# Altium project AES_SSI2130.PrjPcb
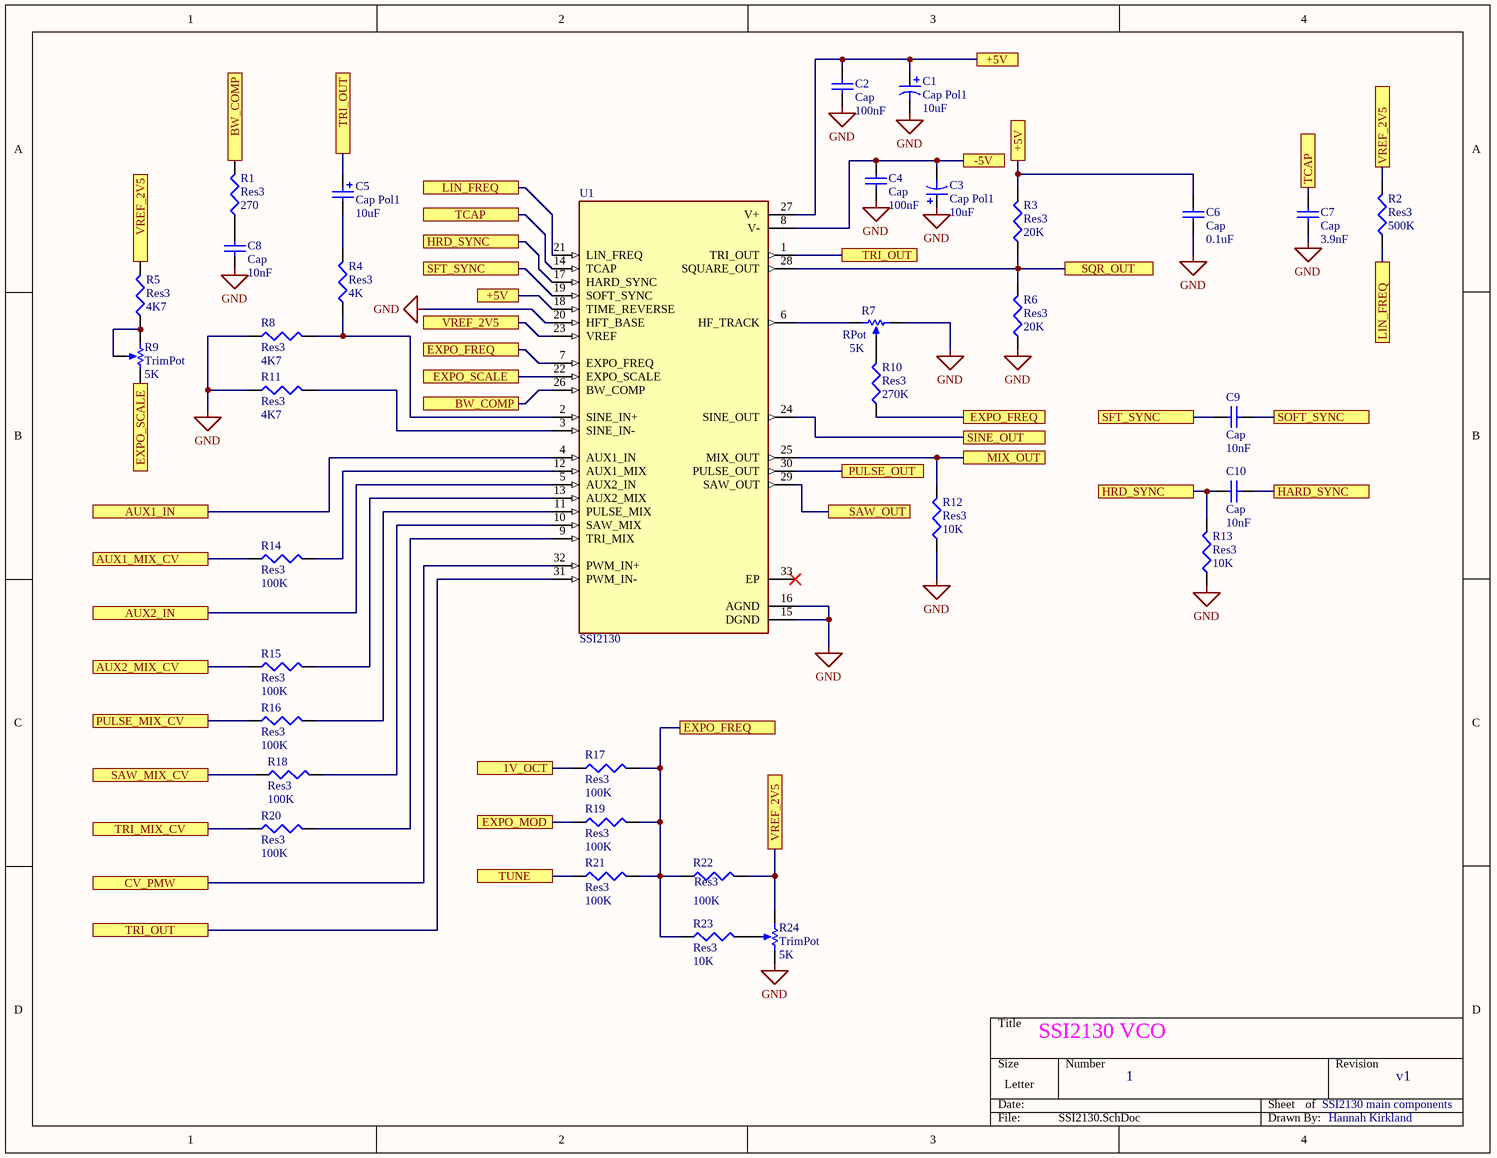
[diagram p0: SSI2130.SchDoc]
Title: Test
7 sheets, 113 parts. Net scope: flat (ports and power ports of the same name join across sheets).
Board file: PCB1.PcbDoc
Sheets:
  SSI2130.SchDoc
  power.SchDoc
  io.SchDoc
  buffNlvlshifter.SchDoc
  flipflop.SchDoc
  buffNlvlshifter2.SchDoc
  Midi_to_CV.SchDoc

## Sheet SSI2130.SchDoc: SSI2130 VCO
size Letter; DrawnBy: Hannah Kirkland; Revision: 1; SheetNumber: 1

### Parts
C1  Cap Pol1  value 10uF  [RB7.6-15]
C2  Cap  value 100nF  [C1206]
C3  Cap Pol1  value 10uF  [RB7.6-15]
C4  Cap  value 100nF  [C1206]
C5  Cap Pol1  value 10uF  [RB7.6-15]
C6  Cap  value 0.1uF  [C1206]
C7  Cap  value 3.9nF  [C1206]
C8  Cap  value 10nF  [C1206]
C9  Cap  value 10nF  [C1206]
C10  Cap  value 10nF  [C1206]
R1  Res3  value 270  [C1206]
R2  Res3  value 500K  [12Z-2010]
R3  Res3  value 20K  [C1206]
R4  Res3  value 4K  [C1206]
R5  Res3  value 4K7  [C1206]
R6  Res3  value 20K  [C1206]
R7  RPot  value 5K  [VR5]
R8  Res3  value 4K7  [C1206]
R9  TrimPot  value 5K  [VR5]
R10  Res3  value 270K  [C1206]
R11  Res3  value 4K7  [C1206]
R12  Res3  value 10K  [C1206]
R13  Res3  value 10K  [C1206]
R14  Res3  value 100K  [C1206]
R15  Res3  value 100K  [C1206]
R16  Res3  value 100K  [C1206]
R17  Res3  value 100K  [C1206]
R18  Res3  value 100K  [C1206]
R19  Res3  value 100K  [C1206]
R20  Res3  value 100K  [C1206]
R21  Res3  value 100K  [C1206]
R22  Res3  value 100K  [C1206]
R23  Res3  value 10K  [C1206]
R24  TrimPot  value 5K  [VR5]
U1  SSI2130  [QFN40P400X400X90-33N]

### Ports
1V_OCT, +5V, -5V, AUX1_IN, AUX1_MIX_CV, AUX2_IN, AUX2_MIX_CV, BW_COMP, CV_PMW, EXPO_FREQ, EXPO_MOD, EXPO_SCALE, HARD_SYNC, HRD_SYNC, LIN_FREQ, MIX_OUT, PULSE_MIX_CV, PULSE_OUT, SAW_MIX_CV, SAW_OUT, SFT_SYNC, SINE_OUT, SOFT_SYNC, SQR_OUT, TCAP, TRI_MIX_CV, TRI_OUT, TUNE, VREF_2V5

### Nets
GND: C1.2 C2.1 C3.1 C4.1 C6.1 C7.1 C8.1 R6.1 R7.2(BOT) R8.1 R11.1 R12.1 R13.1 R24.2(BOT) U1.15(DGND) U1.16(AGND) U1.20(HFT_BASE)
NetC1_1: C1.1 C2.2 C6.2 R3.2 U1.18(TIME_REVERSE) U1.27(V+) ; port +5V
NetC3_2: C3.2 C4.2 U1.8(V-) ; port -5V
NetC5_1: C5.1 U1.1(TRI_OUT) U1.31(PWM_IN-) ; port TRI_OUT
NetC5_2: C5.2 R4.2
NetC7_2: C7.2 U1.14(TCAP) ; port TCAP
NetC8_2: C8.2 R1.1
NetC9_1: C9.1 U1.19(SOFT_SYNC) ; port SFT_SYNC
NetC9_2: C9.2 ; port SOFT_SYNC
NetC10_1: C10.1 R13.2 U1.17(HARD_SYNC) ; port HRD_SYNC
NetC10_2: C10.2 ; port HARD_SYNC
NetC15_1: U1.4(AUX1_IN) ; port AUX1_IN
NetC16_1: U1.5(AUX2_IN) ; port AUX2_IN
NetP1_3: R17.1 ; port 1V_OCT
NetP1_4: R19.1 ; port EXPO_MOD
NetP1_5: R21.1 ; port TUNE
NetP1_8: R14.1 ; port AUX1_MIX_CV
NetP1_9: R15.1 ; port AUX2_MIX_CV
NetP1_10: R16.1 ; port PULSE_MIX_CV
NetP1_11: R18.1 ; port SAW_MIX_CV
NetP1_12: R20.1 ; port TRI_MIX_CV
NetP1_13: R2.1 U1.21(LIN_FREQ) ; port LIN_FREQ
NetP2_6: U1.32(PWM_IN+) ; port CV_PMW
NetP2_11: R2.2 R5.2 R22.2 R24.1(TOP) U1.23(VREF) ; port VREF_2V5
NetR1_2: R1.2 U1.26(BW_COMP) ; port BW_COMP
NetR3_1: R3.1 R6.2 U1.28(SQUARE_OUT) ; port SQR_OUT
NetR4_1: R4.1 R8.2 U1.2(SINE_IN+)
NetR5_1: R5.1 R9.1(TOP) R9.3(TAP)
NetR7_1: R7.1(TOP) U1.6(HF_TRACK)
NetR7_3: R7.3(TAP) R10.2
NetR9_2: R9.2(BOT) U1.22(EXPO_SCALE) ; port EXPO_SCALE
NetR10_1: R10.1 R17.2 R19.2 R21.2 R22.1 R23.1 U1.7(EXPO_FREQ) ; port EXPO_FREQ
NetR11_2: R11.2 U1.3(SINE_IN-)
NetR12_2: R12.2 U1.25(MIX_OUT) ; port MIX_OUT
NetR14_2: R14.2 U1.12(AUX1_MIX)
NetR15_2: R15.2 U1.13(AUX2_MIX)
NetR16_2: R16.2 U1.11(PULSE_MIX)
NetR18_2: R18.2 U1.10(SAW_MIX)
NetR20_2: R20.2 U1.9(TRI_MIX)
NetR23_2: R23.2 R24.3(TAP)
NetR40_1: U1.24(SINE_OUT) ; port SINE_OUT
NetR42_1: U1.30(PULSE_OUT) ; port PULSE_OUT
NetR44_1: U1.29(SAW_OUT) ; port SAW_OUT

Not connected (* = marked no-connect by the designer): U1 33(EP)*

### Notes on the sheet
- SSI2130 VCO
- 1
- SSI2130 main components
- v1
- Hannah Kirkland

### Library data of the parts
C1 C3 C5 = Cap Pol1: Polarized Capacitor (Radial); Published: 8-Jun-2000; LatestRevisionDate: 17-Jul-2002; LatestRevisionNote: Re-released for DXP Platform.; PackageReference: RB7.6-15; Publisher: Altium Limited; PackageDescription: Polarized Capacitor (Radial); 2 Leads
C2 C4 C6-C10 = Cap: Capacitor; Published: 8-Jun-2000; LatestRevisionDate: 17-Jul-2002; LatestRevisionNote: Re-released for DXP Platform.; PackageReference: RAD-0.3; Publisher: Altium Limited; PackageDescription: Radial Cap, Thru-Hole; 2 Leads; 0.3 in Pin Spacing
R1-R6 R8 R10-R23 = Res3: Resistor; Published: 8-Jun-2000; LatestRevisionDate: 29-May-2009; LatestRevisionNote: IPC-7351 Footprint Added.; PackageReference: J1-0603; Publisher: Altium Limited; PackageDescription: Chip Resistor
R7 R9 R24 = RPot: Potentiometer; Sim Note: Enter the Resistance value and the set point into parameter fields.; Set Position: 0.5; Published: 8-Jun-2000; LatestRevisionDate: 17-Jul-2002; LatestRevisionNote: Re-released for DXP Platform.; PackageReference: VR5; Publisher: Altium Limited; PackageDescription: Variable Resistor, Thru-Hole; 3 Leads
U1 = SSI2130: Voltage controlled oscillator subsystem for high-performance electronic musical instruments; MF: Sound Semiconductor; Check_prices: https://www.snapeda.com/parts/SSI2130/Sound%20Semiconductor/view-part/5718733/?ref=eda; SnapEDA_Link: https://www.snapeda.com/parts/SSI2130/Sound%20Semiconductor/view-part/5718733/?ref=snap; Price: None; MP: SSI2130; Value: *; Availability: Unavailable; Package: Package

## Sheet power.SchDoc: Test
size Letter
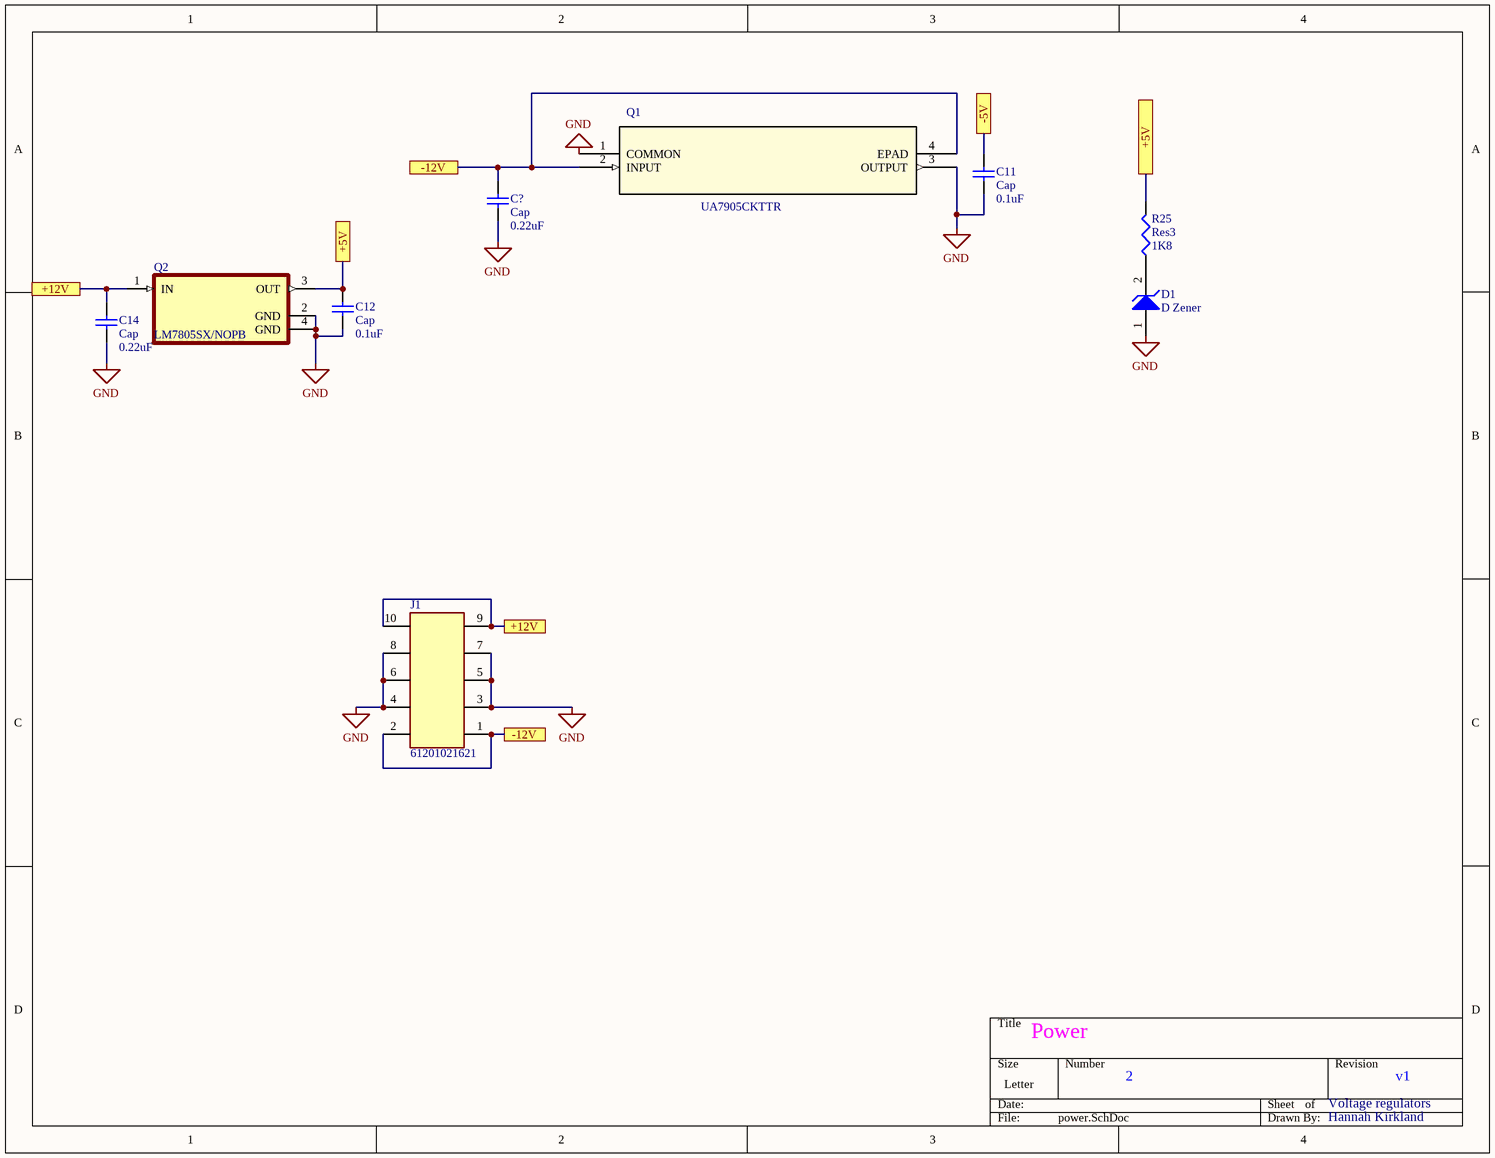
[diagram p1: power.SchDoc]

### Parts
C11  Cap  value 0.1uF  [C1206]
C12  Cap  value 0.1uF  [C1206]
C14  Cap  value 0.22uF  [C1206]
C?  Cap  value 0.22uF  [C1206]
D1  D Zener  [SOT23_N]
J1  61201021621  [61201021621]
Q1  UA7905CKTTR  [TO254P1524X483-4N]
Q2  LM7805SX/NOPB  [TO254P1524X483-4N]
R25  Res3  value 1K8  [C1206]

### Ports
+5V, +12V, -5V, -12V

### Nets
GND: C11.1 C12.1 C14.1 C?.1 D1.1(A) J1.3 J1.4 J1.5 J1.6 J1.7 J1.8 Q1.1(COMMON) Q1.3(OUTPUT) Q2.2(GND) Q2.4(GND)
NetC1_1: C12.2 Q2.3(OUT) R25.2 ; port +5V
NetC3_2: C11.2 ; port -5V
NetC14_2: C14.2 J1.9 J1.10 Q2.1(IN) ; port +12V
NetC18_2: C?.2 J1.1 J1.2 Q1.2(INPUT) Q1.4(EPAD) ; port -12V
NetD1_2: D1.2(K) R25.1

### Notes on the sheet
- Power
- 2
- Voltage regulators
- v1
- Hannah Kirkland

### Library data of the parts
C11 C12 C14 C? = Cap: Capacitor; Published: 8-Jun-2000; LatestRevisionDate: 17-Jul-2002; LatestRevisionNote: Re-released for DXP Platform.; PackageReference: RAD-0.3; Publisher: Altium Limited; PackageDescription: Radial Cap, Thru-Hole; 2 Leads; 0.3 in Pin Spacing
D1 = D Zener: Zener Diode; pin to pad: 1>2 2>3; Published: 8-Jun-2000; LatestRevisionDate: 17-Jul-2002; LatestRevisionNote: Re-released for DXP Platform.; PackageReference: DIODE-0.7; Publisher: Altium Limited; PackageDescription: Diode, Thru-Hole; 2 Leads; 0.7 in Pin Spacing
J1 = 61201021621: Connector Header Through Hole 10 position 0.100 _2.54mm_; MF: Wurth Electronics; Price: None; Package: None; Value: *; MP: 61201021621; Availability: Unavailable; SnapEDA_Link: https://www.snapeda.com/parts/61201021621/Wurth%20Electronics%20Inc./view-part/1156232/?ref=snap
Q1 = UA7905CKTTR: No Description Available; Mfr_Name: Texas Instruments; Type: DEV; Copyright: Copyright (C) 2022 Ultra Librarian. All rights reserved.; Manufacturer_Part_Number: UA7905CKTTR; Digi-Key_Part_Number_1: 296-20799-1-ND; Digi-Key_Part_Number_2: 296-20799-2-ND; Digi-Key_Part_Number_3: 296-20799-6-ND; Digi-Key_Part_Number_4: 2156-UA7905CKTTR-ND; RefDes: RefDes
Q2 = LM7805SX/NOPB: 1.5-A, 30-V, linear voltage regulator 3-DDPAK/TO-263 0 to 125; MF: Texas Instruments; Package: TO-263-3 Texas Instruments; Texas_Instruments-Purchase-URL: https://snapeda.com/shop?store=Texas+Instruments&id=545072; Value: *; Price: None; MP: LM7805SX/NOPB; Availability: Warning; SnapEDA_Link: https://www.snapeda.com/parts/LM7805SX/NOPB/Texas%20Instruments/view-part/545072/?ref=snap; DigiKey-Purchase-URL: https://snapeda.com/shop?store=DigiKey&id=545072; Mouser-Purchase-URL: https://snapeda.com/shop?store=Mouser&id=545072; BuyPart: https://www.snapeda.com/parts/LM7805SX/NOPB/Texas%20Instruments/view-part/545072/?ref=eda
R25 = Res3: Resistor; Published: 8-Jun-2000; LatestRevisionDate: 29-May-2009; LatestRevisionNote: IPC-7351 Footprint Added.; PackageReference: J1-0603; Publisher: Altium Limited; PackageDescription: Chip Resistor

## Sheet io.SchDoc: Test
size Letter
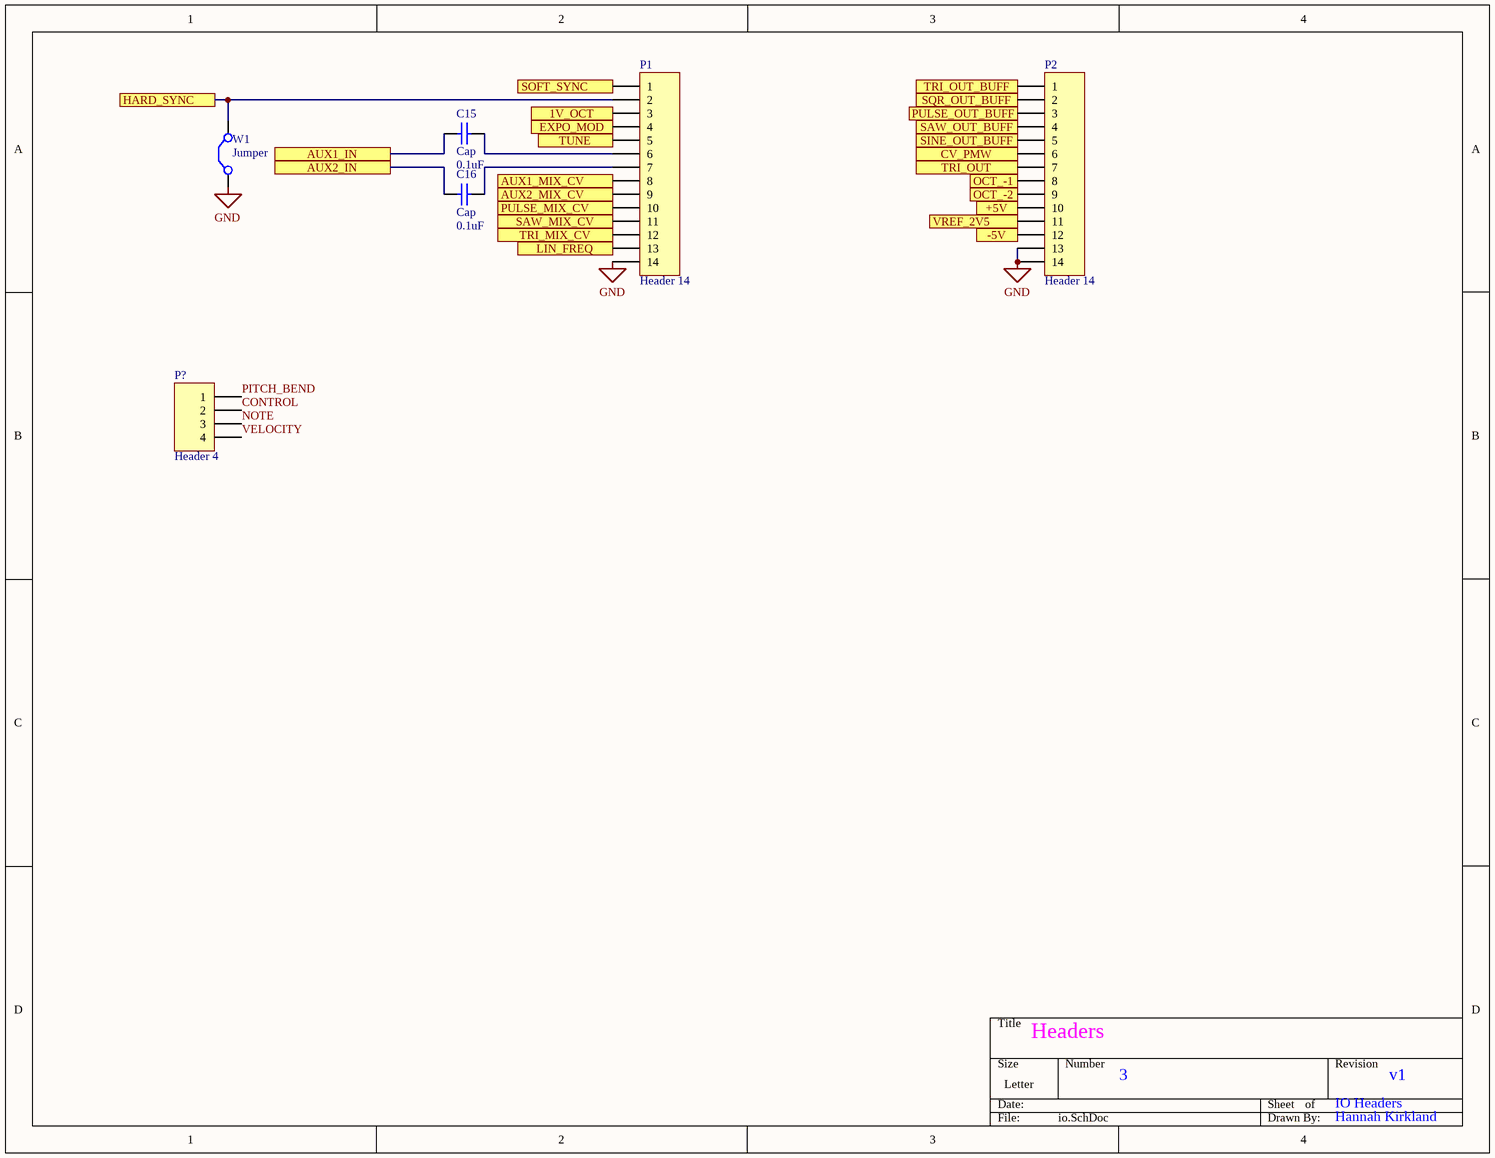
[diagram p2: io.SchDoc]

### Parts
C15  Cap  value 0.1uF  [C1206]
C16  Cap  value 0.1uF  [C1206]
P1  Header 14  [HDR1X14]
P2  Header 14  [HDR1X14]
P?  Header 4  [HDR1X4]
W1  Jumper  [0603]

### Ports
1V_OCT, +5V, -5V, AUX1_IN, AUX1_MIX_CV, AUX2_IN, AUX2_MIX_CV, CV_PMW, EXPO_MOD, HARD_SYNC, LIN_FREQ, OCT_-1, OCT_-2, PULSE_MIX_CV, PULSE_OUT_BUFF, SAW_MIX_CV, SAW_OUT_BUFF, SINE_OUT_BUFF, SOFT_SYNC, SQR_OUT_BUFF, TRI_MIX_CV, TRI_OUT, TRI_OUT_BUFF, TUNE, VREF_2V5

### Nets
GND: P1.14 P2.13 P2.14 W1.1(C1)
CONTROL: P?.2
NOTE: P?.3
PITCH_BEND: P?.1
VELOCITY: P?.4
NetC1_1: P2.10 ; port +5V
NetC3_2: P2.12 ; port -5V
NetC5_1: P2.7 ; port TRI_OUT
NetC9_2: P1.1 ; port SOFT_SYNC
NetC10_2: P1.2 W1.2(C2) ; port HARD_SYNC
NetC15_1: C15.1 ; port AUX1_IN
NetC15_2: C15.2 P1.6
NetC16_1: C16.1 ; port AUX2_IN
NetC16_2: C16.2 P1.7
NetP1_3: P1.3 ; port 1V_OCT
NetP1_4: P1.4 ; port EXPO_MOD
NetP1_5: P1.5 ; port TUNE
NetP1_8: P1.8 ; port AUX1_MIX_CV
NetP1_9: P1.9 ; port AUX2_MIX_CV
NetP1_10: P1.10 ; port PULSE_MIX_CV
NetP1_11: P1.11 ; port SAW_MIX_CV
NetP1_12: P1.12 ; port TRI_MIX_CV
NetP1_13: P1.13 ; port LIN_FREQ
NetP2_1: P2.1 ; port TRI_OUT_BUFF
NetP2_2: P2.2 ; port SQR_OUT_BUFF
NetP2_3: P2.3 ; port PULSE_OUT_BUFF
NetP2_4: P2.4 ; port SAW_OUT_BUFF
NetP2_5: P2.5 ; port SINE_OUT_BUFF
NetP2_6: P2.6 ; port CV_PMW
NetP2_8: P2.8 ; port OCT_-1
NetP2_9: P2.9 ; port OCT_-2
NetP2_11: P2.11 ; port VREF_2V5

### Notes on the sheet
- Headers
- 3
- IO Headers
- v1
- Hannah Kirkland

### Library data of the parts
C15 C16 = Cap: Capacitor; Published: 8-Jun-2000; LatestRevisionDate: 17-Jul-2002; LatestRevisionNote: Re-released for DXP Platform.; PackageReference: RAD-0.3; Publisher: Altium Limited; PackageDescription: Radial Cap, Thru-Hole; 2 Leads; 0.3 in Pin Spacing
P1 P2 = Header 14: Header, 14-Pin; LatestRevisionDate: 17-Jul-2002; LatestRevisionNote: Re-released for DXP Platform.; Publisher: Altium Limited
P? = Header 4: Header, 4-Pin; LatestRevisionDate: 17-Jul-2002; LatestRevisionNote: Re-released for DXP Platform.; Publisher: Altium Limited
W1 = Jumper: Jumper Wire; Published: 24-Mar-1999; LatestRevisionDate: 17-Jul-2002; LatestRevisionNote: Re-released for DXP Platform.; PackageReference: RAD-0.2; Publisher: Altium Limited; PackageDescription: Radial Cap, Thru-Hole; 2 Leads; 0.2 in Pin Spacing

## Sheet buffNlvlshifter.SchDoc: Test
size Letter
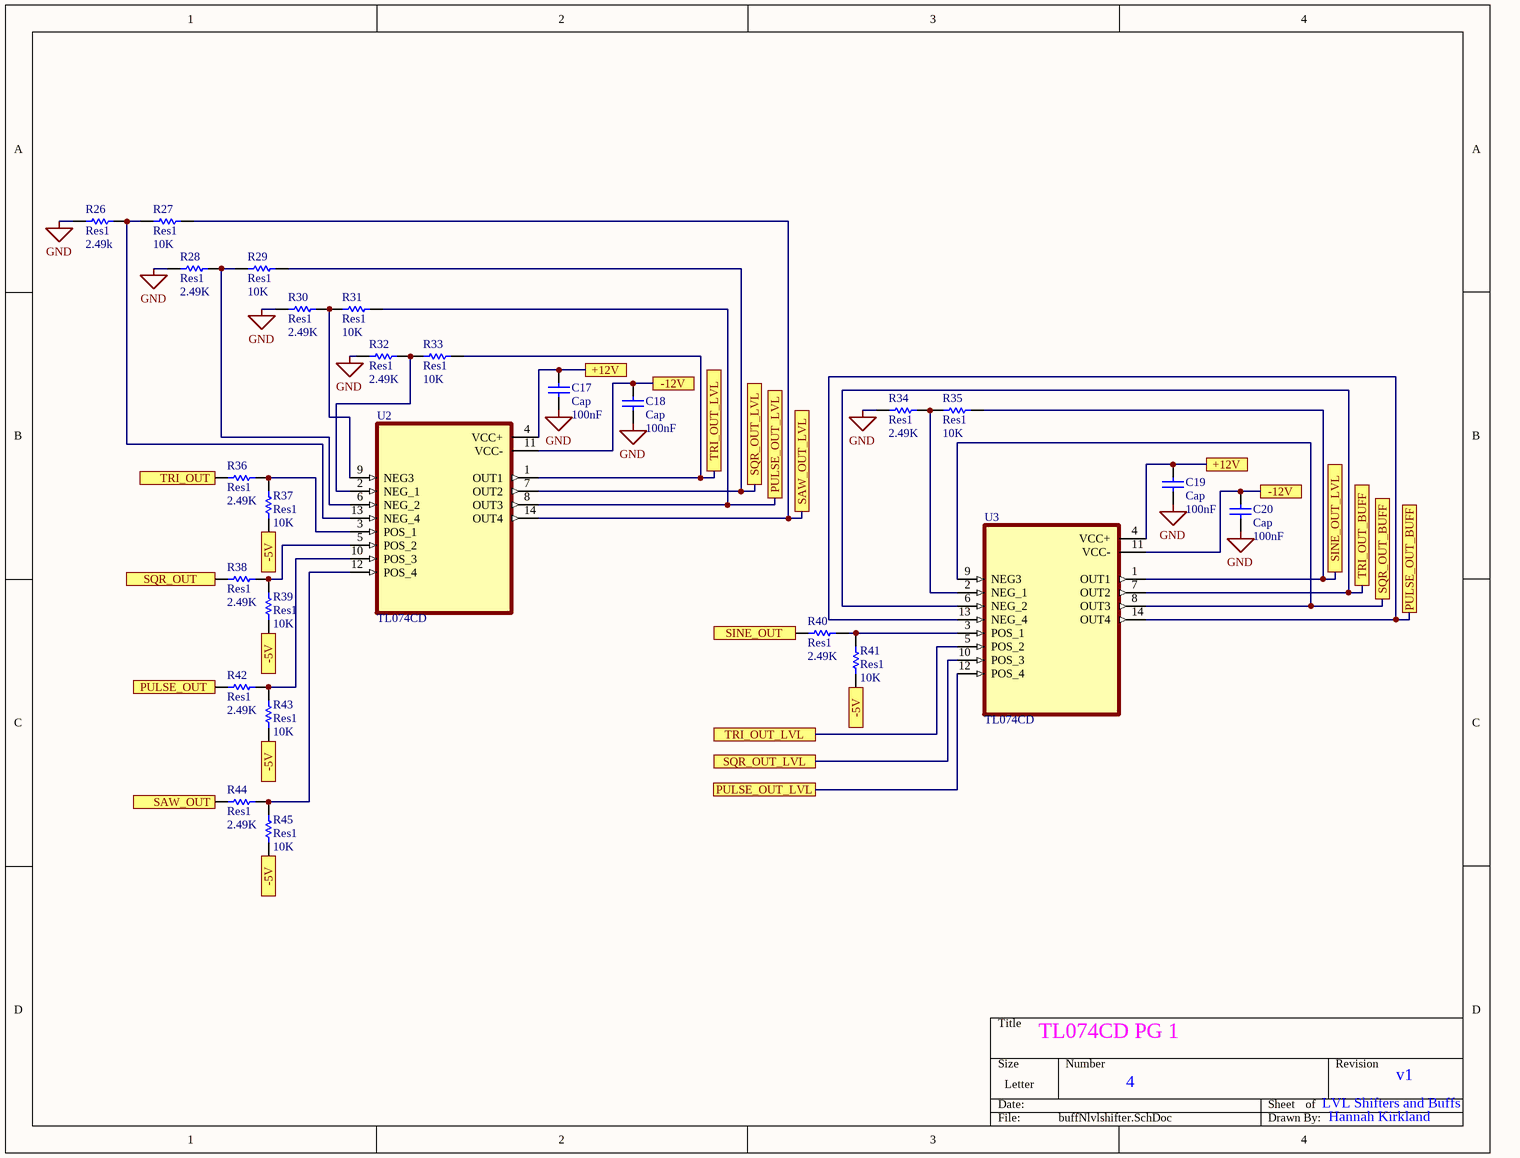
[diagram p3: buffNlvlshifter.SchDoc]

### Parts
C17  Cap  value 100nF  [C1206]
C18  Cap  value 100nF  [C1206]
C19  Cap  value 100nF  [C1206]
C20  Cap  value 100nF  [C1206]
R26  Res1  value 2.49k  [C1206]
R27  Res1  value 10K  [C1206]
R28  Res1  value 2.49K  [C1206]
R29  Res1  value 10K  [C1206]
R30  Res1  value 2.49K  [C1206]
R31  Res1  value 10K  [C1206]
R32  Res1  value 2.49K  [C1206]
R33  Res1  value 10K  [C1206]
R34  Res1  value 2.49K  [C1206]
R35  Res1  value 10K  [C1206]
R36  Res1  value 2.49K  [C1206]
R37  Res1  value 10K  [C1206]
R38  Res1  value 2.49K  [C1206]
R39  Res1  value 10K  [C1206]
R40  Res1  value 2.49K  [C1206]
R41  Res1  value 10K  [C1206]
R42  Res1  value 2.49K  [C1206]
R43  Res1  value 10K  [C1206]
R44  Res1  value 2.49K  [C1206]
R45  Res1  value 10K  [C1206]
U2  TL074CD  [SOIC127P600X175-14N]
U3  TL074CD  [SOIC127P600X175-14N]

### Ports
+12V, -5V, -12V, PULSE_OUT, PULSE_OUT_BUFF, PULSE_OUT_LVL, SAW_OUT, SAW_OUT_LVL, SINE_OUT, SINE_OUT_LVL, SQR_OUT, SQR_OUT_BUFF, SQR_OUT_LVL, TRI_OUT, TRI_OUT_BUFF, TRI_OUT_LVL

### Nets
GND: C17.1 C18.1 C19.1 C20.1 R26.1 R28.1 R30.1 R32.1 R34.1
NetC3_2: R37.1 R39.1 R41.1 R43.1 R45.1 ; port -5V
NetC5_1: R36.1 ; port TRI_OUT
NetC14_2: C17.2 C19.2 U2.4(VCC+) U3.4(VCC+) ; port +12V
NetC18_2: C18.2 C20.2 U2.11(VCC-) U3.11(VCC-) ; port -12V
NetP2_1: U3.6(NEG_2) U3.7(OUT2) ; port TRI_OUT_BUFF
NetP2_2: U3.8(OUT3) U3.9(NEG3) ; port SQR_OUT_BUFF
NetP2_3: U3.13(NEG_4) U3.14(OUT4) ; port PULSE_OUT_BUFF
NetR3_1: R38.1 ; port SQR_OUT
NetR26_2: R26.2 R27.1 U2.13(NEG_4)
NetR27_2: R27.2 U2.14(OUT4) ; port SAW_OUT_LVL
NetR28_2: R28.2 R29.1 U2.6(NEG_2)
NetR29_2: R29.2 U2.7(OUT2) U3.10(POS_3) ; port SQR_OUT_LVL
NetR30_2: R30.2 R31.1 U2.9(NEG3)
NetR31_2: R31.2 U2.8(OUT3) U3.12(POS_4) ; port PULSE_OUT_LVL
NetR32_2: R32.2 R33.1 U2.2(NEG_1)
NetR33_2: R33.2 U2.1(OUT1) U3.5(POS_2) ; port TRI_OUT_LVL
NetR34_2: R34.2 R35.1 U3.2(NEG_1)
NetR35_2: R35.2 U3.1(OUT1) ; port SINE_OUT_LVL
NetR36_2: R36.2 R37.2 U2.3(POS_1)
NetR38_2: R38.2 R39.2 U2.5(POS_2)
NetR40_1: R40.1 ; port SINE_OUT
NetR40_2: R40.2 R41.2 U3.3(POS_1)
NetR42_1: R42.1 ; port PULSE_OUT
NetR42_2: R42.2 R43.2 U2.10(POS_3)
NetR44_1: R44.1 ; port SAW_OUT
NetR44_2: R44.2 R45.2 U2.12(POS_4)

### Notes on the sheet
- TL074CD PG 1
- 4
- LVL Shifters and Buffs
- v1
- Hannah Kirkland

### Library data of the parts
C17-C20 = Cap: Capacitor; Published: 8-Jun-2000; LatestRevisionDate: 17-Jul-2002; LatestRevisionNote: Re-released for DXP Platform.; PackageReference: RAD-0.3; Publisher: Altium Limited; PackageDescription: Radial Cap, Thru-Hole; 2 Leads; 0.3 in Pin Spacing
R26-R45 = Res1: Resistor; Published: 8-Jun-2000; LatestRevisionDate: 17-Jul-2002; LatestRevisionNote: Re-released for DXP Platform.; PackageReference: AXIAL-0.3; Publisher: Altium Limited; PackageDescription: Axial Device, Thru-Hole; 2 Leads; 0.3 in Pin Spacing
U2 U3 = TL074CD: Quad Low-Noise JFET-Input General-Purpose Operational Amplifier 14-SOIC 0 to 70; MF: Texas Instruments; Availability: Good; Mouser-Purchase-URL: https://snapeda.com/shop?store=Mouser&id=4793449; Value: *; SnapEDA_Link: https://www.snapeda.com/parts/TL074CD/Texas%20Instruments/view-part/4793449/?ref=snap; Texas_Instruments-Purchase-URL: https://snapeda.com/shop?store=Texas+Instruments&id=4793449; Price: None; Package: SOIC-14 Texas Instruments; MP: TL074CD; DigiKey-Purchase-URL: https://snapeda.com/shop?store=DigiKey&id=4793449; BuyPart: https://www.snapeda.com/parts/TL074CD/Texas%20Instruments/view-part/4793449/?ref=eda

## Sheet flipflop.SchDoc: Test
size Letter
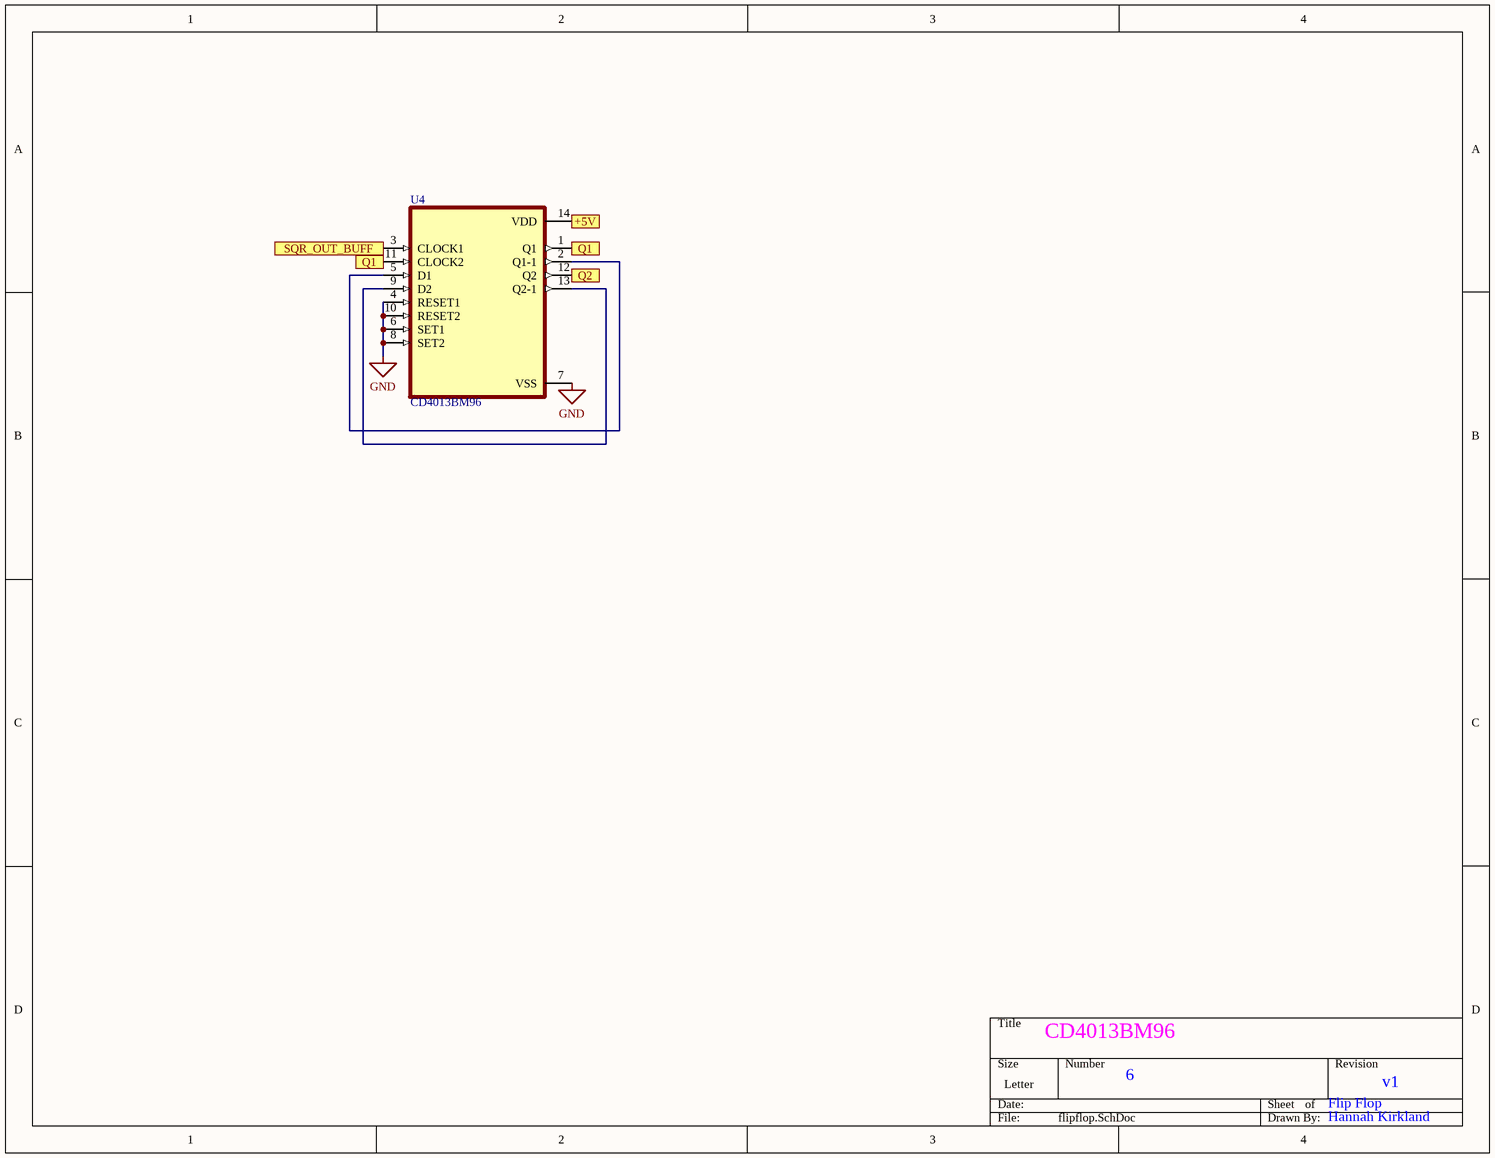
[diagram p4: flipflop.SchDoc]

### Parts
U4  CD4013BM96  [SOIC127P600X175-14N]

### Ports
+5V, Q1, Q2, SQR_OUT_BUFF

### Nets
GND: U4.4(RESET1) U4.6(SET1) U4.7(VSS) U4.8(SET2) U4.10(RESET2)
NetC1_1: U4.14(VDD) ; port +5V
NetP2_2: U4.3(CLOCK1) ; port SQR_OUT_BUFF
NetR48_1: U4.12(Q2) ; port Q2
NetR52_1: U4.1(Q1) U4.11(CLOCK2) ; port Q1
NetU4_2: U4.2(Q1-1) U4.5(D1)
NetU4_9: U4.9(D2) U4.13(Q2-1)

### Notes on the sheet
- CD4013BM96
- 6
- Flip Flop
- v1
- Hannah Kirkland

### Library data of the parts
U4 = CD4013BM96: Package: None; Price: None; Value: *; MP: CD4013BM96; Availability: Unavailable

## Sheet buffNlvlshifter2.SchDoc: Test
size Letter
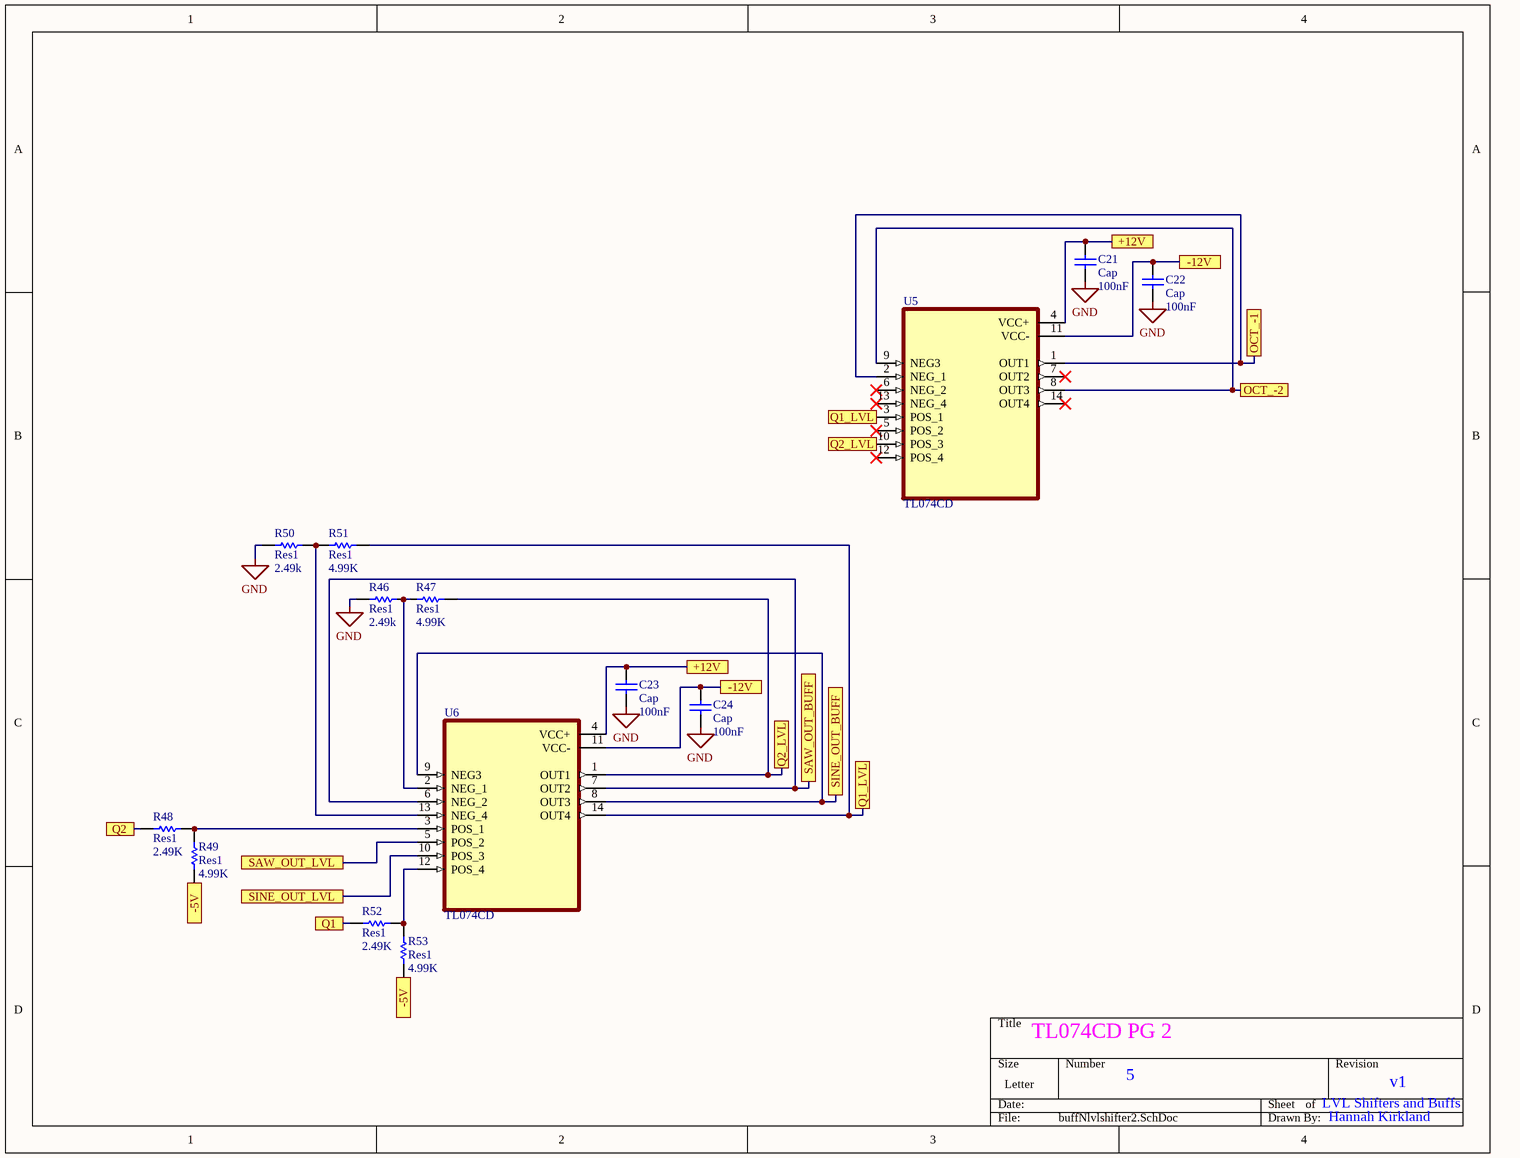
[diagram p5: buffNlvlshifter2.SchDoc]

### Parts
C21  Cap  value 100nF  [C1206]
C22  Cap  value 100nF  [C1206]
C23  Cap  value 100nF  [C1206]
C24  Cap  value 100nF  [C1206]
R46  Res1  value 2.49k  [C1206]
R47  Res1  value 4.99K  [C1206]
R48  Res1  value 2.49K  [C1206]
R49  Res1  value 4.99K  [C1206]
R50  Res1  value 2.49k  [C1206]
R51  Res1  value 4.99K  [C1206]
R52  Res1  value 2.49K  [C1206]
R53  Res1  value 4.99K  [C1206]
U5  TL074CD  [SOIC127P600X175-14N]
U6  TL074CD  [SOIC127P600X175-14N]

### Ports
+12V, -5V, -12V, OCT_-1, OCT_-2, Q1, Q1_LVL, Q2, Q2_LVL, SAW_OUT_BUFF, SAW_OUT_LVL, SINE_OUT_BUFF, SINE_OUT_LVL

### Nets
GND: C21.1 C22.1 C23.1 C24.1 R46.1 R50.1
NetC3_2: R49.1 R53.1 ; port -5V
NetC14_2: C21.2 C23.2 U5.4(VCC+) U6.4(VCC+) ; port +12V
NetC18_2: C22.2 C24.2 U5.11(VCC-) U6.11(VCC-) ; port -12V
NetP2_4: U6.6(NEG_2) U6.7(OUT2) ; port SAW_OUT_BUFF
NetP2_5: U6.8(OUT3) U6.9(NEG3) ; port SINE_OUT_BUFF
NetP2_8: U5.1(OUT1) U5.2(NEG_1) ; port OCT_-1
NetP2_9: U5.8(OUT3) U5.9(NEG3) ; port OCT_-2
NetR27_2: U6.5(POS_2) ; port SAW_OUT_LVL
NetR35_2: U6.10(POS_3) ; port SINE_OUT_LVL
NetR46_2: R46.2 R47.1 U6.2(NEG_1)
NetR47_2: R47.2 U5.10(POS_3) U6.1(OUT1) ; port Q2_LVL
NetR48_1: R48.1 ; port Q2
NetR48_2: R48.2 R49.2 U6.3(POS_1)
NetR50_2: R50.2 R51.1 U6.13(NEG_4)
NetR51_2: R51.2 U5.3(POS_1) U6.14(OUT4) ; port Q1_LVL
NetR52_1: R52.1 ; port Q1
NetR52_2: R52.2 R53.2 U6.12(POS_4)

Not connected (* = marked no-connect by the designer): U5 5(POS_2)* 6(NEG_2)* 7(OUT2)* 12(POS_4)* 13(NEG_4)* 14(OUT4)*

### Notes on the sheet
- TL074CD PG 2
- 5
- LVL Shifters and Buffs
- v1
- Hannah Kirkland

### Library data of the parts
C21-C24 = Cap: Capacitor; Published: 8-Jun-2000; LatestRevisionDate: 17-Jul-2002; LatestRevisionNote: Re-released for DXP Platform.; PackageReference: RAD-0.3; Publisher: Altium Limited; PackageDescription: Radial Cap, Thru-Hole; 2 Leads; 0.3 in Pin Spacing
R46-R53 = Res1: Resistor; Published: 8-Jun-2000; LatestRevisionDate: 17-Jul-2002; LatestRevisionNote: Re-released for DXP Platform.; PackageReference: AXIAL-0.3; Publisher: Altium Limited; PackageDescription: Axial Device, Thru-Hole; 2 Leads; 0.3 in Pin Spacing
U5 U6 = TL074CD: as U2 on sheet buffNlvlshifter; Availability: Good; Mouser-Purchase-URL: https://snapeda.com/shop?store=Mouser&id=4793449; Value: *; SnapEDA_Link: https://www.snapeda.com/parts/TL074CD/Texas%20Instruments/view-part/4793449/?ref=snap; Texas_Instruments-Purchase-URL: https://snapeda.com/shop?store=Texas+Instruments&id=4793449; Price: None; Package: SOIC-14 Texas Instruments; MP: TL074CD; DigiKey-Purchase-URL: https://snapeda.com/shop?store=DigiKey&id=4793449; BuyPart: https://www.snapeda.com/parts/TL074CD/Texas%20Instruments/view-part/4793449/?ref=eda

## Sheet Midi_to_CV.SchDoc: Test
size 381 x 241 mm
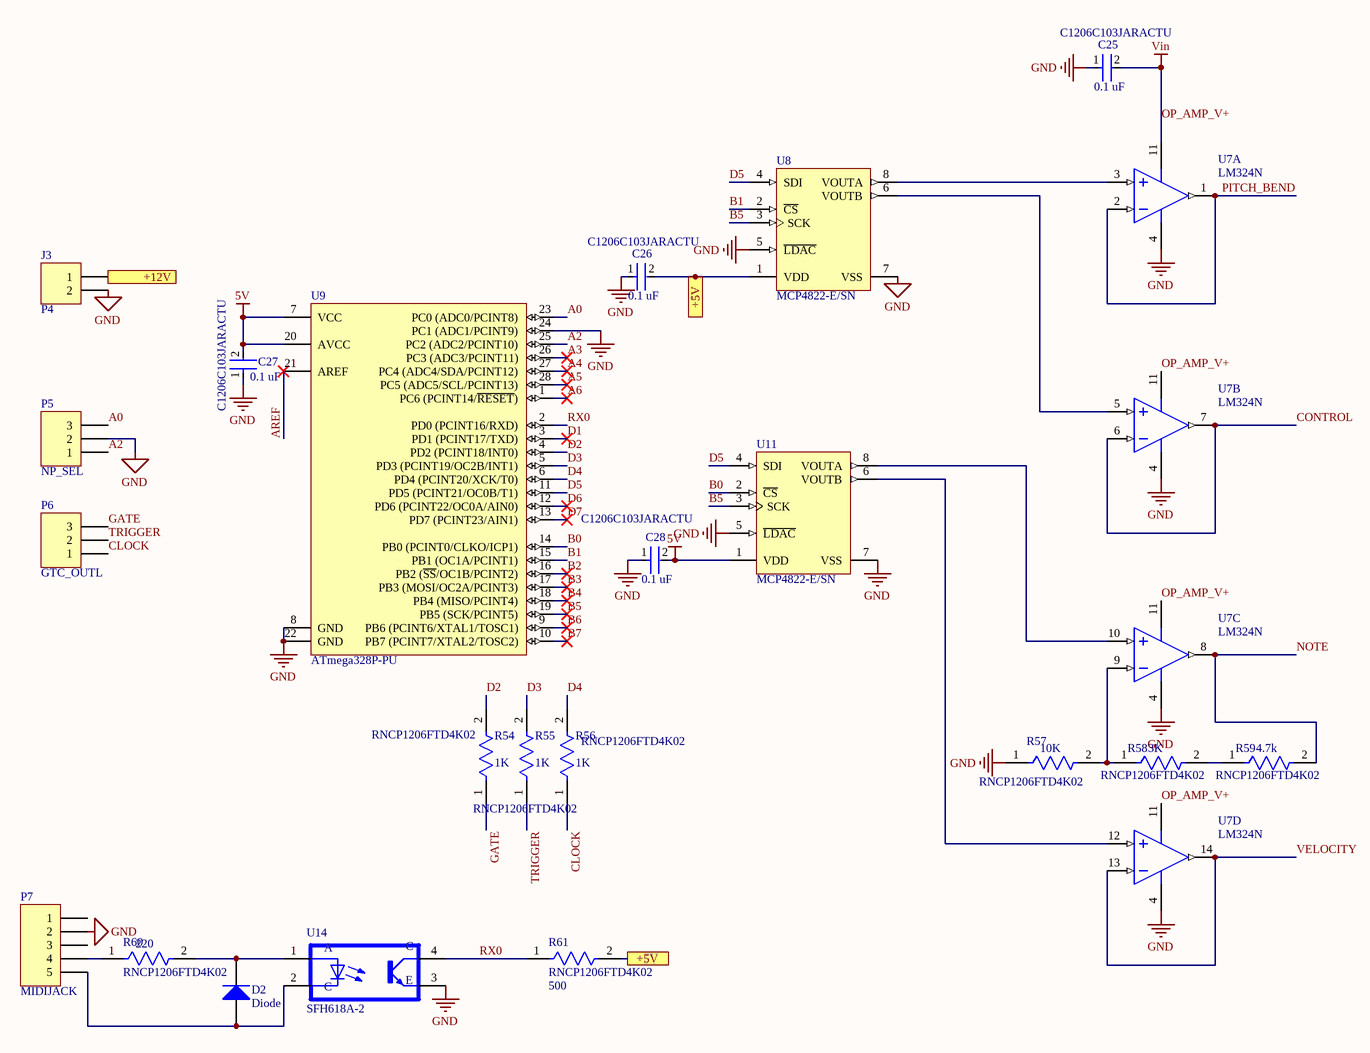
[diagram p6: Midi_to_CV.SchDoc]

### Parts
C25  C1206C103JARACTU  Capacitance: 0.1 uF  [C1206]
C26  C1206C103JARACTU  Capacitance: 0.1 uF  [C1206]
C27  C1206C103JARACTU  Capacitance: 0.1 uF  [C1206]
C28  C1206C103JARACTU  Capacitance: 0.1 uF  [C1206]
D2  Diode  [DIODE-0.4]
P4  J3  [HDR1X2]
P5  NP_SEL  [HDR1X3]
P6  GTC_OUTL  [HDR1X3]
P7  MIDIJACK  [HDR1X5]
R54  RNCP1206FTD4K02  Resistance: 1K  [C1206]
R55  RNCP1206FTD4K02  Resistance: 1K  [C1206]
R56  RNCP1206FTD4K02  Resistance: 1K  [C1206]
R57  RNCP1206FTD4K02  Resistance: 10K  [C1206]
R58  RNCP1206FTD4K02  Resistance: 3K  [C1206]
R59  RNCP1206FTD4K02  Resistance: 4.7k  [C1206]
R60  RNCP1206FTD4K02  Resistance: 220  [C1206]
R61  RNCP1206FTD4K02  Resistance: 500  [C1206]
U7  LM324N  [DIP-14]  (parts A,B,C,D of 4)
U8  MCP4822-E/SN  [SO8_L]
U9  ATmega328P-PU  [DIP787W46P254L3467H508Q28]
U11  MCP4822-E/SN  [SO8_L]
U14  SFH618A-2  [DIP-4]

### Ports
+5V, +12V

### Nets
5V: C27.2 C28.2 U9.7(VCC) U9.20(AVCC) U11.1(VDD)
GND: C25.1 C26.1 C27.1 C28.1 P4.2 P5.2 P7.2 R57.1 U7.4(V+) U8.5(~{LDAC}) U8.7(VSS) U9.8(GND) U9.22(GND) U9.24(PC1_(ADC1/PCINT9)) U11.5(~{LDAC}) U11.7(VSS) U14.3(E)
OP_AMP_V+: C25.2 U7.11(GND)  [also labelled Vin]
A0: P5.3 U9.23(PC0_(ADC0/PCINT8))
A2: P5.1 U9.25(PC2_(ADC2/PCINT10))
A3: U9.26(PC3_(ADC3/PCINT11))
A4: U9.27(PC4_(ADC4/SDA/PCINT12))
A5: U9.28(PC5_(ADC5/SCL/PCINT13))
A6: U9.1(PC6_(PCINT14/~{RESET}))
AREF: U9.21(AREF)
B0: U9.14(PB0_(PCINT0/CLKO/ICP1)) U11.2(~{CS})
B1: U8.2(~{CS}) U9.15(PB1_(OC1A/PCINT1))
B2: U9.16(PB2_(~{SS}/OC1B/PCINT2))
B3: U9.17(PB3_(MOSI/OC2A/PCINT3))
B4: U9.18(PB4_(MISO/PCINT4))
B5: U8.3(SCK) U9.19(PB5_(SCK/PCINT5)) U11.3(SCK)
B6: U9.9(PB6_(PCINT6/XTAL1/TOSC1))
B7: U9.10(PB7_(PCINT7/XTAL2/TOSC2))
CLOCK: P6.1 R56.1
CONTROL: U7.6(IN2-) U7.7(OUT2)
D1: U9.3(PD1_(PCINT17/TXD))
D2: R54.2 U9.4(PD2_(PCINT18/INT0))
D3: R55.2 U9.5(PD3_(PCINT19/OC2B/INT1))
D4: R56.2 U9.6(PD4_(PCINT20/XCK/T0))
D5: U8.4(SDI) U9.11(PD5_(PCINT21/OC0B/T1)) U11.4(SDI)
D6: U9.12(PD6_(PCINT22/OC0A/AIN0))
D7: U9.13(PD7_(PCINT23/AIN1))
GATE: P6.3 R54.1
NOTE: R59.2 U7.8(OUT3)
PITCH_BEND: U7.1(OUT1) U7.2(IN1-)
RX0: R61.1 U9.2(PD0_(PCINT16/RXD)) U14.4(CO)
TRIGGER: P6.2 R55.1
VELOCITY: U7.13(IN4-) U7.14(OUT4)
NetC1_1: C26.2 R61.2 U8.1(VDD) ; port +5V
NetC14_2: P4.1 ; port +12V
NetD2_1: D2.1(A) P7.5 U14.2(C)
NetD2_2: D2.2(K) R60.2 U14.1(A)
NetP7_4: P7.4 R60.1
NetR57_2: R57.2 R58.1 U7.9(IN3-)
NetR58_2: R58.2 R59.1
NetU7_3: U7.3(IN1+) U8.8(VOUTA)
NetU7_5: U7.5(IN2+) U8.6(VOUTB)
NetU7_10: U7.10(IN3+) U11.8(VOUTA)
NetU7_12: U7.12(IN4+) U11.6(VOUTB)

Not connected (* = marked no-connect by the designer): P7 1 3

### Library data of the parts
C25-C28 = b4654b650e69147ec39a6b967a45e02: CAP CER 10000PF 250V 5% X7R 1206; Manufacturer: KEMET; Automotive Grade: Grade 0; Tolerance: 0.05; Material: Ceramic; Value: 10,000 pF; Temperature Coefficient: 15%; Ipc Land Pattern Name: CAPC320160X78; Lead Free: Yes; Device Class L2: Capacitors; ComponentLink2URL: https://content.kemet.com/datasheets/KEM_C1007_X8R_ULTRA_150C_SMD.pdf; Automotive: Yes; Voltage Rating: 250 V; Device Class L1: Passive Components; ComponentLink2Description: Datasheet; Manufacturer Part Number: C1206C103JARACTU; Temperature Range Low: -55°C; RoHS: TRUE; Device Class L3: Ceramic Capacitors; Temperature Range High: +150°C; Temperature: -55°C to +150°C; Height: 0.88mm; Category: Cap; Digikey Description: CAP CER 10000PF 250V 5% X7R 1206; Octopart: https://octopart.com/c1206c103jaractu-kemet-17306149; Package: C1206C-EB; Temperature Characteristic: X7R
D2 = Diode: Default Diode; Published: 8-Jun-2000; LatestRevisionDate: 17-Jul-2002; LatestRevisionNote: Re-released for DXP Platform.; PackageVersion: Sep-1996; PackageReference: SMC; Publisher: Altium Limited; PackageDescription: DO-214-AB/SMC; 2 C-Bend Leads; Body 7.9 x 5.9 mm, inc. leads (LxW); Code_JEDEC: DO-214-AB
P4 = Header 2: Header, 2-Pin; LatestRevisionDate: 17-Jul-2002; LatestRevisionNote: Re-released for DXP Platform.; Publisher: Altium Limited
P5 P6 = Header 3: Header, 3-Pin; LatestRevisionDate: 17-Jul-2002; LatestRevisionNote: Re-released for DXP Platform.; Publisher: Altium Limited
P7 = Header 5: Header, 5-Pin; LatestRevisionDate: 17-Jul-2002; LatestRevisionNote: Re-released for DXP Platform.; Publisher: Altium Limited
R54-R61 = 1029c3af85768c4190bb7ad29bc67b5: 4.02kΩ ±1% 0.5W 1206 High Power Anti-Sulfur Thin Film Chip Resistor; Max Power Dissipation: 500mW; Temperature Coefficient: 100ppm/°C; Width: 0.059inch; Mount: Surface Mount; Length: 0.122inch; Min Operating Temperature: -55°C; Max Operating Temperature: 155°C; RoHS Compliant: Yes; Resistor Type: Thin Film; Case Code (Metric): 3216; Case Code (Imperial): 1206; Lead Free: Lead Free; Height: 0.024inch; Series: RNCP; Number of Terminations: 2; Case/Package: 1206; Tolerance: 1%; Features: Moisture Resistant; Packaging: Cut Tape
U7 = AMP-OPA-LM124-14: Low Power Quad Operational Amplifier, 14-pin MDIP; Manufacturer: Texas Instruments; CompType: Amplifiers; PowerWise: N; PackageTopMarking: NSUZXYYTTE#*LM324N; PackageDescription: MDIP, .750 x .250 x.130in, 14 Lead, .100in Pitch; Package Reference: N0014A; RoHS: N; Code_JEDEC: MS-001-AA; ComponentLink1URL: http://www.ti.com/general/docs/lit/getliterature.tsp?genericPartNumber=LM324&fileType=pdf; ComponentLink1Description: Datasheet URL; PinCount: 14
U8 U11 = CON-DAC-MCP4822-8: 12-Bit DACs with Internal VREF and SPI Interface, 8-Pin SOIC 150mil, Extended Temperature; DatasheetVersion: revA, Apr-2010; ComponentLink3Description: Package Specification; Code_IPC: SOIC127P600-8; ComponentLink2URL: http://ww1.microchip.com/downloads/en/DeviceDoc/22249A.pdf; PackageVersion: revBB, Aug-2009; ComponentLink1Description: Manufacturer URL; PackageDescription: 8-Lead Plastic Small Outline (SN) - Narrow, 3.90mm Body [SOIC]; ComponentLink1URL: http://www.microchip.com/; PackageReference: SOIC-SN8; Code_JEDEC: MS-012; ComponentLink2Description: Datasheet; RevisionNote: URLs added. DatasheetVersion updated. Sch updated.; ComponentLink3URL: http://www.microchip.com/stellent/groups/techpub_sg/documents/packagingspec/en012702.pdf
U9 = MC-8B-ATM48-IL28: 8-bit AVR Microcontroller, 32KB Flash, 1KB EEPROM, 2KB SRAM, 28-pin PDIP, Industrial Grade (-40°C to 85°C); RevisionNote: DatasheetVersion updated. URLs added.; PackageVersion: revB, Sep-2001; PackageDescription: 28-lead (0.300"/7.62mm Wide) Plastic Dual Inline Package (PDIP); DatasheetVersion: revD, May-2011; ComponentLink1Description: Manufacturer URL; ComponentLink1URL: http://www.atmel.com/; PackageReference: 28P3; ComponentLink2Description: ATmega48A/48PA/88A/88PA/168A/168PA/328/328P Datasheet; ComponentLink3URL: http://www.atmel.com/dyn/resources/prod_documents/8271S.pdf; ComponentLink2URL: http://www.atmel.com/dyn/resources/prod_documents/8271.pdf; ComponentLink3Description: ATmega48A/48PA/88A/88PA/168A/168PA/328/328P Summary
U14 = SFH618A-2: Package: None; Price: None; Value: *; MP: SFH618A-2; Availability: Unavailable

## Nets that join several sheets
GND: SSI2130 (17 pins), power (15 pins), io (P1.14 P2.13 P2.14 W1.1), buffNlvlshifter (9 pins), flipflop (5 pins), buffNlvlshifter2 (6 pins), Midi_to_CV (17 pins)
NetC1_1: SSI2130 (6 pins), power (C12.2 Q2.3 R25.2), io (P2.10), flipflop (U4.14), Midi_to_CV (C26.2 R61.2 U8.1)
NetC3_2: SSI2130 (C3.2 C4.2 U1.8), power (C11.2), io (P2.12), buffNlvlshifter (5 pins), buffNlvlshifter2 (R49.1 R53.1)
NetC5_1: SSI2130 (C5.1 U1.1 U1.31), io (P2.7), buffNlvlshifter (R36.1)
NetC9_2: SSI2130 (C9.2), io (P1.1)
NetC10_2: SSI2130 (C10.2), io (P1.2 W1.2)
NetC14_2: power (C14.2 J1.9 J1.10 Q2.1), buffNlvlshifter (C17.2 C19.2 U2.4 U3.4), buffNlvlshifter2 (C21.2 C23.2 U5.4 U6.4), Midi_to_CV (P4.1)
NetC15_1: SSI2130 (U1.4), io (C15.1)
NetC16_1: SSI2130 (U1.5), io (C16.1)
NetC18_2: power (5 pins), buffNlvlshifter (C18.2 C20.2 U2.11 U3.11), buffNlvlshifter2 (C22.2 C24.2 U5.11 U6.11)
NetP1_3: SSI2130 (R17.1), io (P1.3)
NetP1_4: SSI2130 (R19.1), io (P1.4)
NetP1_5: SSI2130 (R21.1), io (P1.5)
NetP1_8: SSI2130 (R14.1), io (P1.8)
NetP1_9: SSI2130 (R15.1), io (P1.9)
NetP1_10: SSI2130 (R16.1), io (P1.10)
NetP1_11: SSI2130 (R18.1), io (P1.11)
NetP1_12: SSI2130 (R20.1), io (P1.12)
NetP1_13: SSI2130 (R2.1 U1.21), io (P1.13)
NetP2_1: io (P2.1), buffNlvlshifter (U3.6 U3.7)
NetP2_2: io (P2.2), buffNlvlshifter (U3.8 U3.9), flipflop (U4.3)
NetP2_3: io (P2.3), buffNlvlshifter (U3.13 U3.14)
NetP2_4: io (P2.4), buffNlvlshifter2 (U6.6 U6.7)
NetP2_5: io (P2.5), buffNlvlshifter2 (U6.8 U6.9)
NetP2_6: SSI2130 (U1.32), io (P2.6)
NetP2_8: io (P2.8), buffNlvlshifter2 (U5.1 U5.2)
NetP2_9: io (P2.9), buffNlvlshifter2 (U5.8 U5.9)
NetP2_11: SSI2130 (5 pins), io (P2.11)
NetR3_1: SSI2130 (R3.1 R6.2 U1.28), buffNlvlshifter (R38.1)
NetR27_2: buffNlvlshifter (R27.2 U2.14), buffNlvlshifter2 (U6.5)
NetR35_2: buffNlvlshifter (R35.2 U3.1), buffNlvlshifter2 (U6.10)
NetR40_1: SSI2130 (U1.24), buffNlvlshifter (R40.1)
NetR42_1: SSI2130 (U1.30), buffNlvlshifter (R42.1)
NetR44_1: SSI2130 (U1.29), buffNlvlshifter (R44.1)
NetR48_1: flipflop (U4.12), buffNlvlshifter2 (R48.1)
NetR52_1: flipflop (U4.1 U4.11), buffNlvlshifter2 (R52.1)